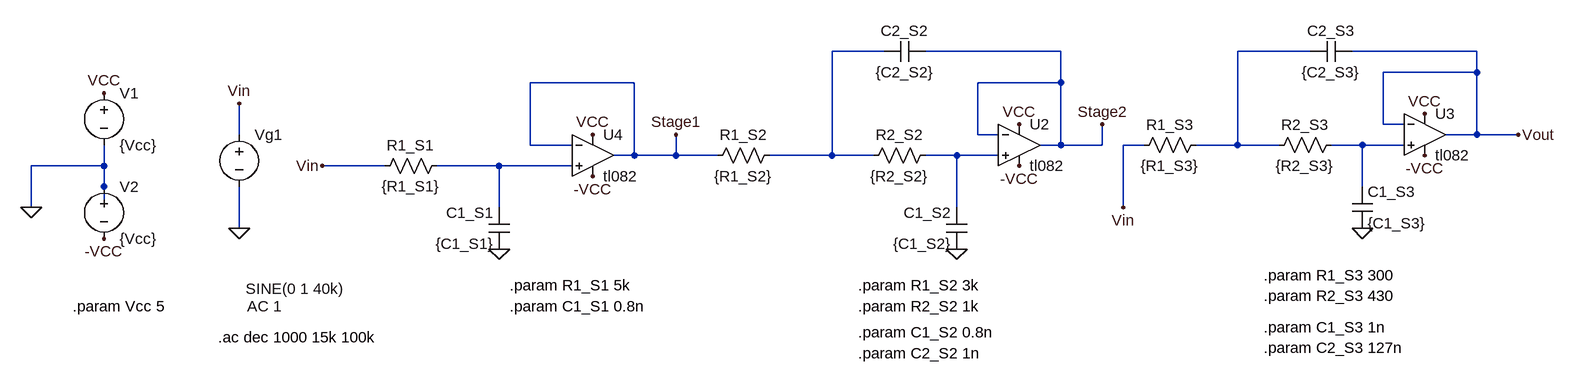
[diagram p0: schematic Filtro_V2.asc]
Filtro_V2.asc, the LTspice schematic file:
Version 4
SHEET 1 3612 680
WIRE 1136 -224 1056 -224
WIRE 1408 -224 1200 -224
WIRE 1792 -224 1680 -224
WIRE 2048 -224 1856 -224
WIRE 2048 -192 2048 -224
WIRE 2048 -192 1904 -192
WIRE 752 -176 592 -176
WIRE 1408 -176 1408 -224
WIRE 1408 -176 1280 -176
WIRE 1904 -112 1904 -192
WIRE 1936 -112 1904 -112
WIRE 144 -96 144 -144
WIRE 1280 -96 1280 -176
WIRE 1312 -96 1280 -96
WIRE 2048 -96 2048 -192
WIRE 2048 -96 2000 -96
WIRE 2112 -96 2048 -96
WIRE 592 -80 592 -176
WIRE 656 -80 592 -80
WIRE 1408 -80 1408 -176
WIRE 1408 -80 1376 -80
WIRE 1472 -80 1472 -112
WIRE 1472 -80 1408 -80
WIRE 1536 -80 1504 -80
WIRE 1680 -80 1680 -224
WIRE 1680 -80 1616 -80
WIRE 1744 -80 1680 -80
WIRE 1872 -80 1824 -80
WIRE 1936 -80 1872 -80
WIRE 752 -64 752 -176
WIRE 752 -64 720 -64
WIRE 816 -64 816 -96
WIRE 816 -64 752 -64
WIRE 880 -64 816 -64
WIRE 1056 -64 1056 -224
WIRE 1056 -64 960 -64
WIRE 1120 -64 1056 -64
WIRE 1248 -64 1200 -64
WIRE 1312 -64 1248 -64
WIRE -64 -48 -64 -80
WIRE -64 -48 -176 -48
WIRE 368 -48 272 -48
WIRE 544 -48 448 -48
WIRE 656 -48 544 -48
WIRE -64 -16 -64 -48
WIRE 1872 -16 1872 -80
WIRE -176 16 -176 -48
WIRE -64 16 -64 -16
WIRE 544 16 544 -48
WIRE 1248 16 1248 -64
WIRE 1504 16 1504 -80
WIRE 144 48 144 -16
FLAG -64 -160 VCC
FLAG -64 64 -VCC
FLAG -176 16 0
FLAG 688 -96 VCC
FLAG 688 -32 -VCC
FLAG 144 48 0
FLAG 544 80 0
FLAG 1344 -112 VCC
FLAG 1344 -48 -VCC
FLAG 1248 80 0
FLAG 1968 -128 VCC
FLAG 1968 -64 -VCC
FLAG 1872 48 0
FLAG 2112 -96 Vout
FLAG 816 -96 Stage1
FLAG 1472 -112 Stage2
FLAG 144 -144 Vin
FLAG 272 -48 Vin
FLAG 1504 16 Vin
SYMBOL voltage -64 -176 R0
WINDOW 123 0 0 Left 0
WINDOW 39 0 0 Left 0
SYMATTR InstName V1
SYMATTR Value {Vcc}
SYMBOL voltage -64 -32 R0
WINDOW 123 0 0 Left 0
WINDOW 39 0 0 Left 0
SYMATTR InstName V2
SYMATTR Value {Vcc}
SYMBOL res 464 -64 R90
WINDOW 0 0 56 VBottom 2
WINDOW 3 32 56 VTop 2
SYMATTR InstName R1_S1
SYMATTR Value {R1_S1}
SYMBOL cap 560 80 R180
WINDOW 0 24 56 Left 2
WINDOW 3 24 8 Left 2
SYMATTR InstName C1_S1
SYMATTR Value {C1_S1}
SYMBOL voltage 144 -112 R0
WINDOW 123 12 280 Left 2
WINDOW 39 0 0 Left 0
WINDOW 3 10 253 Left 2
SYMATTR Value2 AC 1
SYMATTR Value SINE(0 1 40k)
SYMATTR InstName Vg1
SYMBOL tl082 1344 -80 R0
SYMATTR InstName U2
SYMBOL res 976 -80 R90
WINDOW 0 0 56 VBottom 2
WINDOW 3 32 56 VTop 2
SYMATTR InstName R1_S2
SYMATTR Value {R1_S2}
SYMBOL res 1216 -80 R90
WINDOW 0 0 56 VBottom 2
WINDOW 3 32 56 VTop 2
SYMATTR InstName R2_S2
SYMATTR Value {R2_S2}
SYMBOL res 1632 -96 R90
WINDOW 0 0 56 VBottom 2
WINDOW 3 32 56 VTop 2
SYMATTR InstName R1_S3
SYMATTR Value {R1_S3}
SYMBOL cap 1264 80 R180
WINDOW 0 24 56 Left 2
WINDOW 3 24 8 Left 2
SYMATTR InstName C1_S2
SYMATTR Value {C1_S2}
SYMBOL cap 1136 -208 R270
WINDOW 0 32 32 VTop 2
WINDOW 3 0 32 VBottom 2
SYMATTR InstName C2_S2
SYMATTR Value {C2_S2}
SYMBOL tl082 1968 -96 R0
SYMATTR InstName U3
SYMBOL res 1840 -96 R90
WINDOW 0 0 56 VBottom 2
WINDOW 3 32 56 VTop 2
SYMATTR InstName R2_S3
SYMATTR Value {R2_S3}
SYMBOL cap 1792 -208 R270
WINDOW 0 32 32 VTop 2
WINDOW 3 0 32 VBottom 2
SYMATTR InstName C2_S3
SYMATTR Value {C2_S3}
SYMBOL cap 1856 -16 R0
SYMATTR InstName C1_S3
SYMATTR Value {C1_S3}
SYMBOL tl082 688 -64 R0
SYMATTR InstName U4
TEXT -112 168 Left 2 !.param Vcc 5
TEXT 560 136 Left 2 !.param R1_S1 5k
TEXT 560 168 Left 2 !.param C1_S1 0.8n
TEXT 112 216 Left 2 !.ac dec 1000 15k 100k
TEXT 1720 120 Left 2 !.param R1_S3 300
TEXT 1096 136 Left 2 !.param R1_S2 3k
TEXT 1096 240 Left 2 !.param C2_S2 1n
TEXT 1096 208 Left 2 !.param C1_S2 0.8n
TEXT 1096 168 Left 2 !.param R2_S2 1k
TEXT 1720 152 Left 2 !.param R2_S3 430
TEXT 1720 232 Left 2 !.param C2_S3 127n
TEXT 1720 200 Left 2 !.param C1_S3 1n

The netlist it stands for:
* Filtro_V2.asc
V1 VCC 0 {Vcc}
V2 0 -VCC {Vcc}
R1_S1 N005 Vin {R1_S1}
C1_S1 0 N005 {C1_S1}
Vg1 Vin 0 SINE(0 1 40k) AC 1
* U2: tl082 (symbol tl082 not available, pins judged from their places): In+=N004 In-=Stage2 V+=VCC V-=-VCC OUT=Stage2
R1_S2 N001 Stage1 {R1_S2}
R2_S2 N004 N001 {R2_S2}
R1_S3 N002 Vin {R1_S3}
C1_S2 0 N004 {C1_S2}
C2_S2 N001 Stage2 {C2_S2}
* U3: tl082 (symbol tl082 not available, pins judged from their places): In+=N003 In-=Vout V+=VCC V-=-VCC OUT=Vout
R2_S3 N003 N002 {R2_S3}
C2_S3 N002 Vout {C2_S3}
C1_S3 N003 0 {C1_S3}
* U4: tl082 (symbol tl082 not available, pins judged from their places): In+=N005 In-=Stage1 V+=VCC V-=-VCC OUT=Stage1
.param Vcc 5
.param R1_S1 5k
.param C1_S1 0.8n
.ac dec 1000 15k 100k
.param R1_S3 300
.param R1_S2 3k
.param C2_S2 1n
.param C1_S2 0.8n
.param R2_S2 1k
.param R2_S3 430
.param C2_S3 127n
.param C1_S3 1n
.backanno
.end